# Altium schematic sheet DS18B20.SchDoc
size A4
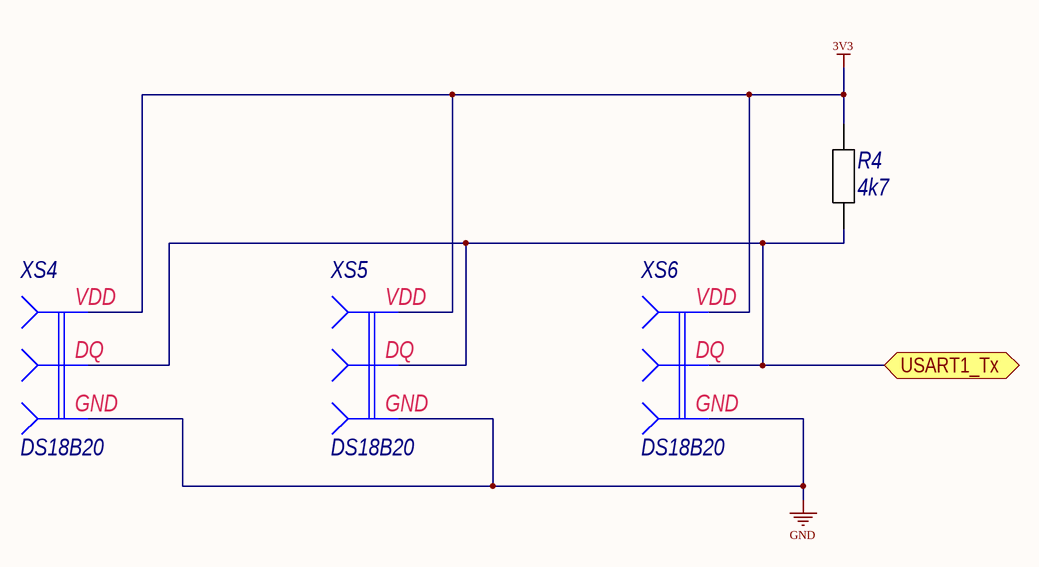
[diagram p0: DS18B20.SchDoc]

## Parts
R4  4k7  [C0805R]
XS4  DS18B20  [YX-XH-3]
XS5  DS18B20  [YX-XH-3]
XS6  DS18B20  [YX-XH-3]

## Ports
USART1_Tx (bidir)

## Nets
3V3: R4.1 XS4.1 XS5.1 XS6.1
GND: XS4.3 XS5.3 XS6.3
USART1_Tx: R4.2 XS4.2 XS5.2 XS6.2 ; port USART1_Tx

## Notes on the sheet
- (in symbol DS18B20) VDD; DQ; GND

## Library data of the parts
R4 = R0805: Published: 24.03.2010; Publisher: Andrew Danich; Type: Резистор
XS4-XS6 = DS18B20: Published: 07.03.2013; Publisher: Andrew Danich; Type: Розетка